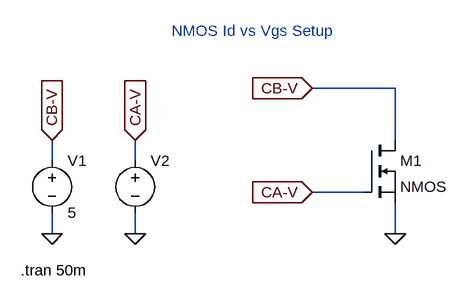
[diagram p0: schematic nmos_id_vs_vgs_ltspice.asc]
nmos_id_vs_vgs_ltspice.asc, the LTspice schematic file:
Version 4
SHEET 1 880 680
WIRE 176 32 48 32
WIRE 176 112 176 32
WIRE -352 144 -352 112
WIRE -224 144 -224 112
WIRE 128 192 48 192
WIRE -352 256 -352 224
WIRE -224 256 -224 224
WIRE 176 256 176 208
FLAG 176 256 0
FLAG 48 32 CB-V
IOPIN 48 32 In
FLAG 48 192 CA-V
IOPIN 48 192 In
FLAG -352 256 0
FLAG -224 256 0
FLAG -352 112 CB-V
IOPIN -352 112 In
FLAG -224 112 CA-V
IOPIN -224 112 In
SYMBOL nmos 128 112 R0
SYMATTR InstName M1
SYMBOL voltage -352 128 R0
WINDOW 123 0 0 Left 0
WINDOW 39 0 0 Left 0
SYMATTR InstName V1
SYMATTR Value 5
SYMBOL voltage -224 128 R0
WINDOW 3 24 96 Invisible 2
SYMATTR InstName V2
SYMATTR Value PWL REPEAT FOREVER(0 2.75 2.5m 4.5 5m 2.75 7.5m 1 10m 2.75) ENDREPEAT
TEXT -168 -56 Left 2 ;NMOS Id vs Vgs Setup
TEXT -400 312 Left 2 !.tran 50m

The netlist it stands for:
* nmos_id_vs_vgs_ltspice.asc
M1 CB-V CA-V 0 0 NMOS
V1 CB-V 0 5
V2 CA-V 0 PWL REPEAT FOREVER(0 2.75 2.5m 4.5 5m 2.75 7.5m 1 10m 2.75) ENDREPEAT
.model NMOS NMOS
.model PMOS PMOS
.lib standard.mos
* NMOS Id vs Vgs Setup
.tran 50m
.backanno
.end